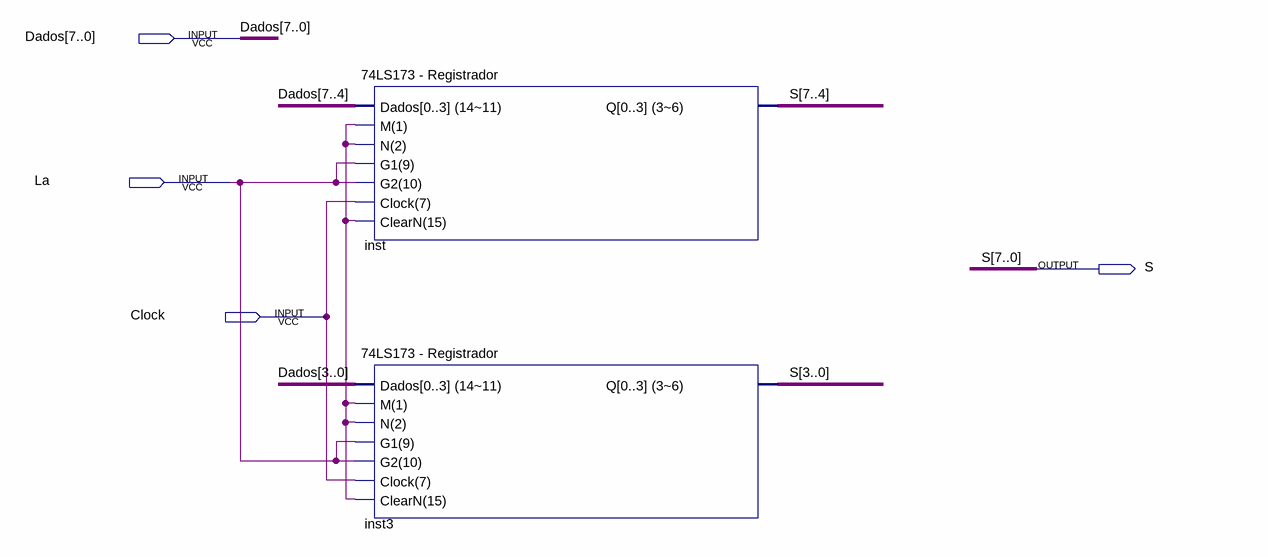
[diagram p0: schematic sheet]
// Quartus schematic Acumulador_B.bdf as structural Verilog: 2 symbols, 4 pins
module Acumulador_B (
  input  [7:0] Dados,
  input  La,
  input  Clock,
  output S
);

  wire undriven;
  wire [7:0] S_bus;

  \74LS173_-_Registrador  inst (
    .\Dados[0..3]_(14~11) (Dados[7:4]), .\M(1) (undriven), .\N(2) (undriven), .\G1(9) (La), .\G2(10) (La),
    .\Clock(7) (Clock), .\ClearN(15) (undriven), .\Q[0..3]_(3~6) (S_bus[7:4]));
  \74LS173_-_Registrador  inst3 (
    .\Dados[0..3]_(14~11) (Dados[3:0]), .\M(1) (undriven), .\N(2) (undriven), .\G1(9) (La), .\G2(10) (La),
    .\Clock(7) (Clock), .\ClearN(15) (undriven), .\Q[0..3]_(3~6) (S_bus[3:0]));
endmodule
